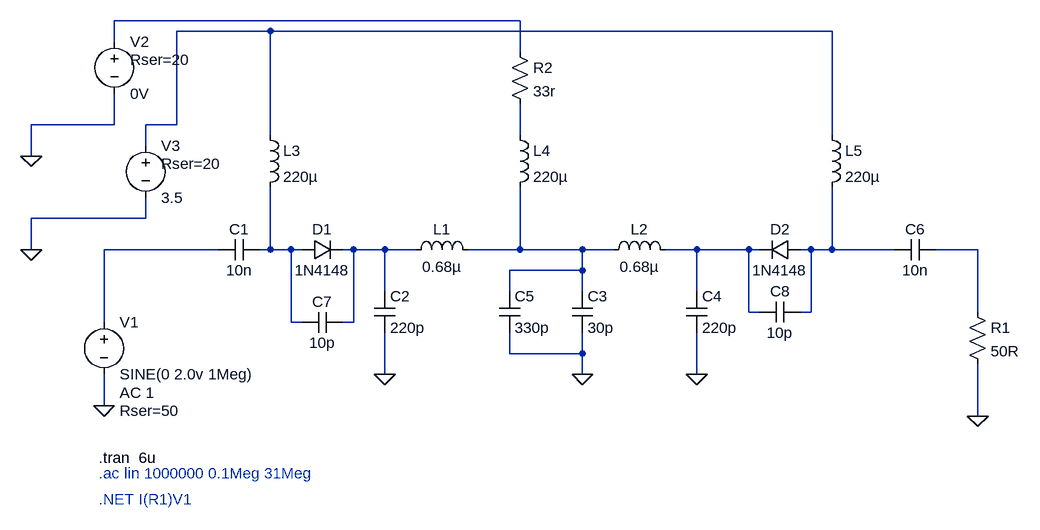
[diagram p0: schematic switched_20m_lpf.asc]
switched_20m_lpf.asc, the LTspice schematic file:
Version 4
SHEET 1 1380 680
WIRE 608 -320 -16 -320
WIRE 224 -304 80 -304
WIRE 1088 -304 224 -304
WIRE -16 -288 -16 -320
WIRE 608 -272 608 -320
WIRE -16 -160 -16 -208
WIRE -16 -160 -144 -160
WIRE 80 -160 80 -304
WIRE 80 -160 32 -160
WIRE 224 -144 224 -304
WIRE 608 -144 608 -192
WIRE 1088 -144 1088 -304
WIRE 32 -128 32 -160
WIRE -144 -112 -144 -160
WIRE 32 -16 32 -48
WIRE 32 -16 -144 -16
WIRE -144 32 -144 -16
WIRE 144 32 -32 32
WIRE 224 32 224 -64
WIRE 224 32 208 32
WIRE 256 32 224 32
WIRE 272 32 256 32
WIRE 352 32 336 32
WIRE 400 32 352 32
WIRE 448 32 400 32
WIRE 608 32 608 -64
WIRE 608 32 528 32
WIRE 704 32 608 32
WIRE 752 32 704 32
WIRE 880 32 832 32
WIRE 960 32 880 32
WIRE 976 32 960 32
WIRE 1056 32 1040 32
WIRE 1088 32 1088 -64
WIRE 1088 32 1056 32
WIRE 1184 32 1088 32
WIRE 1312 32 1248 32
WIRE 704 64 704 32
WIRE 704 64 592 64
WIRE 400 96 400 32
WIRE 592 96 592 64
WIRE 704 96 704 64
WIRE 880 96 880 32
WIRE 960 128 960 32
WIRE 976 128 960 128
WIRE 1056 128 1056 32
WIRE 1056 128 1040 128
WIRE 1312 128 1312 32
WIRE -32 144 -32 32
WIRE 256 144 256 32
WIRE 272 144 256 144
WIRE 352 144 352 32
WIRE 352 144 336 144
WIRE 592 192 592 160
WIRE 704 192 704 160
WIRE 704 192 592 192
WIRE 400 224 400 160
WIRE 704 224 704 192
WIRE 880 224 880 160
WIRE -32 272 -32 224
WIRE 1312 288 1312 208
FLAG -32 272 0
FLAG 1312 288 0
FLAG 400 224 0
FLAG 704 224 0
FLAG 880 224 0
FLAG -144 -112 0
FLAG -144 32 0
SYMBOL voltage -32 128 R0
WINDOW 123 24 124 Left 2
WINDOW 39 24 152 Left 2
SYMATTR Value2 AC 1
SYMATTR SpiceLine Rser=50
SYMATTR InstName V1
SYMATTR Value SINE(0 2.0v 1Meg)
SYMBOL cap 208 16 R90
WINDOW 0 0 32 VBottom 2
WINDOW 3 32 32 VTop 2
SYMATTR InstName C1
SYMATTR Value 10n
SYMBOL res 1296 112 R0
SYMATTR InstName R1
SYMATTR Value 50R
SYMBOL cap 384 96 R0
SYMATTR InstName C2
SYMATTR Value 220p
SYMBOL cap 688 96 R0
SYMATTR InstName C3
SYMATTR Value 30p
SYMBOL cap 864 96 R0
SYMATTR InstName C4
SYMATTR Value 220p
SYMBOL ind 432 48 R270
WINDOW 0 32 56 VTop 2
WINDOW 3 5 56 VBottom 2
SYMATTR InstName L1
SYMATTR Value 0.68µ
SYMBOL ind 736 48 R270
WINDOW 0 32 56 VTop 2
WINDOW 3 5 56 VBottom 2
SYMATTR InstName L2
SYMATTR Value 0.68µ
SYMBOL cap 576 96 R0
SYMATTR InstName C5
SYMATTR Value 330p
SYMBOL diode 272 48 R270
WINDOW 0 32 32 VTop 2
WINDOW 3 0 32 VBottom 2
SYMATTR InstName D1
SYMATTR Value 1N4148
SYMBOL diode 1040 16 R90
WINDOW 0 0 32 VBottom 2
WINDOW 3 32 32 VTop 2
SYMATTR InstName D2
SYMATTR Value 1N4148
SYMBOL ind 208 -160 R0
SYMATTR InstName L3
SYMATTR Value 220µ
SYMBOL ind 592 -160 R0
SYMATTR InstName L4
SYMATTR Value 220µ
SYMBOL ind 1072 -160 R0
SYMATTR InstName L5
SYMATTR Value 220µ
SYMBOL cap 1248 16 R90
WINDOW 0 0 32 VBottom 2
WINDOW 3 32 32 VTop 2
SYMATTR InstName C6
SYMATTR Value 10n
SYMBOL Voltage -16 -304 R0
WINDOW 123 0 0 Left 0
WINDOW 39 24 44 Left 2
SYMATTR InstName V2
SYMATTR Value 0V
SYMATTR SpiceLine Rser=20
SYMBOL Cap 336 128 R90
WINDOW 0 0 32 VBottom 2
WINDOW 3 32 32 VTop 2
SYMATTR InstName C7
SYMATTR Value 10p
SYMBOL Cap 1040 112 R90
WINDOW 0 0 32 VBottom 2
WINDOW 3 32 32 VTop 2
SYMATTR InstName C8
SYMATTR Value 10p
SYMBOL Voltage 32 -144 R0
WINDOW 123 0 0 Left 0
WINDOW 39 24 44 Left 2
SYMATTR InstName V3
SYMATTR Value 3.5
SYMATTR SpiceLine Rser=20
SYMBOL Res 592 -288 R0
SYMATTR InstName R2
SYMATTR Value 33r
TEXT -40 376 Left 2 ;.ac lin 1000000 0.1Meg 31Meg
TEXT -40 416 Left 2 ;.NET I(R1)V1
TEXT -40 352 Left 2 !.tran  6u

The netlist it stands for:
* switched_20m_lpf.asc
V1 N004 0 SINE(0 2.0v 1Meg) AC 1 Rser=50
C1 N005 N004 10n
R1 N010 0 50R
C2 N006 0 220p
C3 N007 0 30p
C4 N008 0 220p
L1 N006 N007 0.68µ
L2 N007 N008 0.68µ
C5 N007 0 330p
D1 N005 N006 1N4148
D2 N009 N008 1N4148
L3 N002 N005 220µ
L4 N003 N007 220µ
L5 N002 N009 220µ
C6 N010 N009 10n
V2 N001 0 0V Rser=20
C7 N006 N005 10p
C8 N009 N008 10p
V3 N002 0 3.5 Rser=20
R2 N001 N003 33r
.model D D
.lib standard.dio
* .ac lin 1000000 0.1Meg 31Meg
* .NET I(R1)V1
.tran  6u
.backanno
.end